# EAGLE board Mk3 Prototype (EAGLE 6.5.0), part 1 of 2
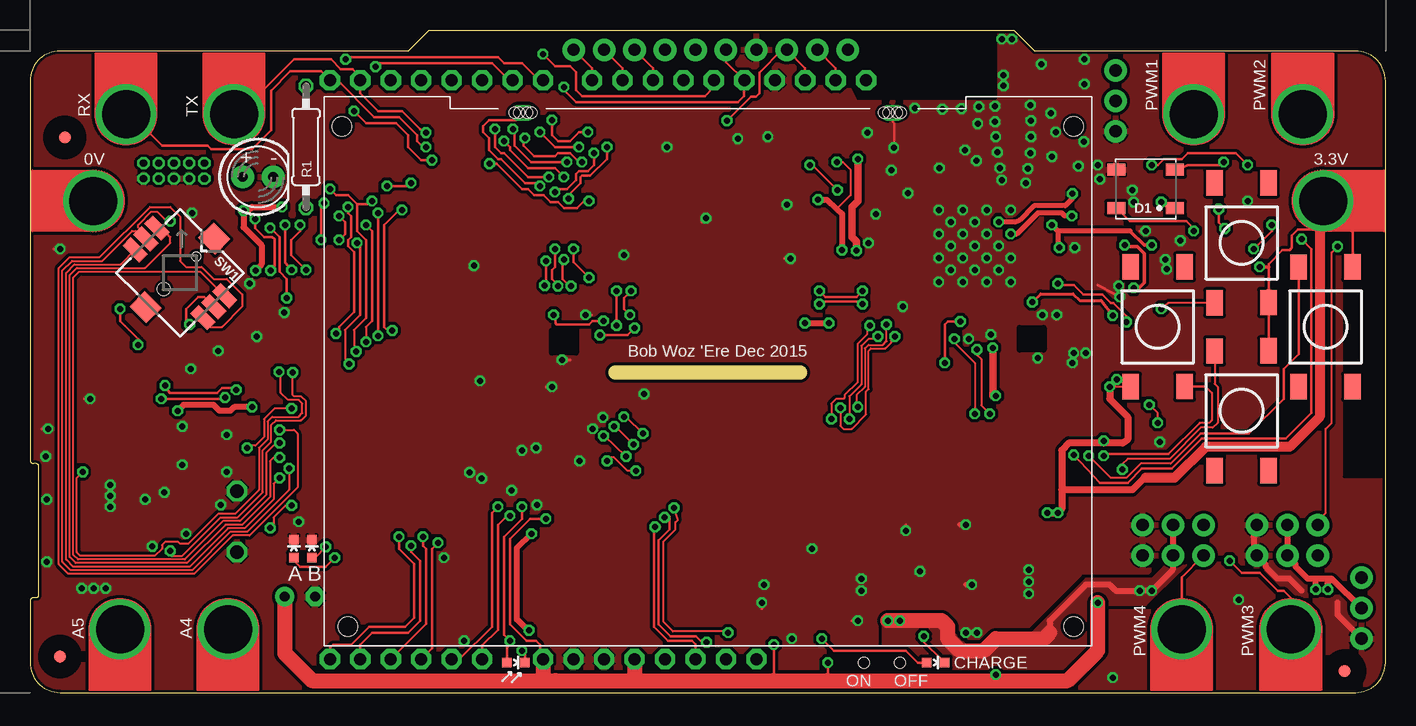
[diagram p2: board, top side]
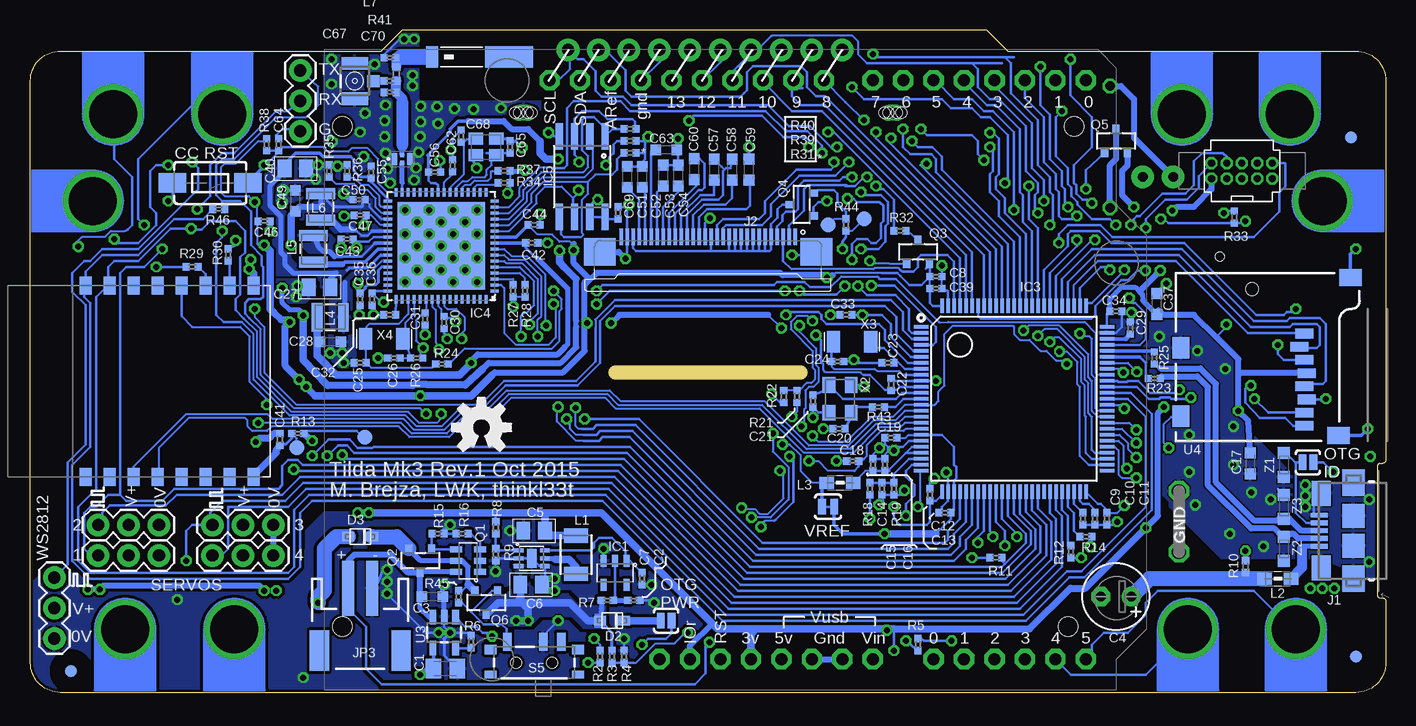
[diagram p3: board, bottom side, seen from below]

Size 113 x 55.25 mm. Coordinates in mm from the lower left corner, seen from the top.
Outline: 48.8,26.7 64.2,26.7
Outline: 2.5,0 110.5,0 arc90 113,2.5 113,51 arc90 110.5,53.5 83.75,53.5 82,55.25 33.25,55.25 31.5,53.5 2.5,53.5 arc90 0,51 0,19.4 arc90 0.3,19.1 0.5,19.1 arc-90 0.7,18.9 0.7,8.1 arc-90 0.5,7.9 0.3,7.9 arc90 0,7.6 0,2.5 arc90 2.5,0
Copper layers (1*16): Top 0.035mm / dielectric 1.4mm / Bottom 0.035mm
Design rules "TiLDA Mk3 DRC Rules *": minimum track width 0.15mm, minimum drill 0.5mm, track to track 0.15mm, track to pad 0.15mm, pad to pad 0.15mm, via to via 0.15mm, smd to smd 0.05mm, copper to edge 0.2mm, drill to drill 12mil, minimum pad ring 8mil, minimum via ring 8mil, stop-mask expansion 2mil, vias tented up to drill 25mil, thermal gap 0.15mm
Net classes: 0 default: width 0.15 mm, drill 0.3 mm; 1 ANT: width 1.27 mm, drill 0.4 mm, clearance 0.4 mm; 2 90R: width 0.5 mm, drill 0.3 mm, clearance 0.7 mm to class 0, clearance 0.1 mm; 3 100R: width 0.15 mm, drill 0.3 mm, clearance 0.6 mm to class 2, clearance 0.4 mm; 4 5V0: width 0.406 mm, drill 0.3 mm, clearance 0.6 mm to class 2, clearance 0.6 mm to class 3; 5 3V3: width 0.254 mm, drill 0.3 mm, clearance 0.6 mm to class 2, clearance 0.6 mm to class 3; 6 1V8: width 0.254 mm, drill 0.3 mm, clearance 0.6 mm to class 2, clearance 0.6 mm to class 3; 7 H5V0: width 0.254 mm, drill 0.3 mm, clearance 0.6 mm to class 2, clearance 0.6 mm to class 3; 8 MAINS: clearance 4 mm to class 0, clearance 4 mm to class 1, clearance 4 mm to class 2, clearance 4 mm to class 3, clearance 4 mm to class 4, clearance 4 mm to class 5, clearance 4 mm to class 6, clearance 4 mm to class 7, clearance 4 mm

## Footprints (pad centres in the part's own frame; a part is rotated, then mirrored left to right if it is on the bottom)
2450AT42A100 = smd 1 x 1.8: P$1 -0.5,0 | smd 4 x 1.8: P$2 5.9,0
C0805K = smd 1.3 x 1.6: 1 -1,0; 2 1,0
C0402-SMALLER = smd 0.6 x 0.6: 1 -0.5,0; 2 0.5,0
C0603K-SMALL = smd 0.889 x 0.889: 1 -0.875,0; 2 0.875,0
E2,5-6 = drill 0.813 pad 1.6: + -1.27,0 | drill 0.813 pad 1.6 octagon: - 1.27,0
C0805-N = smd 1.15 x 1.45: 1 -0.9,0; 2 0.9,0
WS2812B = smd 1.5 x 1: 1 -2.45,1.6; 2 -2.45,-1.6; 3 2.45,-1.6; 4 2.45,1.6
SOD-323F = smd 1 x 0.8: A -1,0; C 1,0
FIDUCIAL-1X2.5-STOP = smd 1 x 1: 1 0,0
DEA202450BT = smd 0.45 x 1: GND@2 0.65,0; GND@4 -0.65,0 | smd 0.35 x 0.35: IN 0,-0.325; OUT 0,0.325
GND-LOOP = drill 1.15 octagon: P$3 -2.54,0; P$4 2.54,0
SSOP5 = smd 0.5 x 1: 1 -0.95,-1; 2 0,-1; 3 0.95,-1; 4 0.95,1; 5 -0.95,1
DFN6 = smd 0.35 x 0.8: 1 -0.65,-1.1; 2 0,-1.1; 3 0.65,-1.1; 4 0.65,1.1; 5 0,1.1; 6 -0.65,1.1 | smd 1.6 x 0.8: EP 0,0
TQFP100 = smd 0.3 x 1.2: 1 -6,-7.75; 2 -5.5,-7.75; 3 -5,-7.75; 4 -4.5,-7.75; 5 -4,-7.75; 6 -3.5,-7.75; 7 -3,-7.75; 8 -2.5,-7.75; 9 -2,-7.75; 10 -1.5,-7.75; 11 -1,-7.75; 12 -0.5,-7.75; 13 0,-7.75; 14 0.5,-7.75; 15 1,-7.75; 16 1.5,-7.75; 17 2,-7.75; 18 2.5,-7.75; 19 3,-7.75; 20 3.5,-7.75; 21 4,-7.75; 22 4.5,-7.75; 23 5,-7.75; 24 5.5,-7.75; 25 6,-7.75; 51 6,7.75; 52 5.5,7.75; 53 5,7.75; 54 4.5,7.75; 55 4,7.75; 56 3.5,7.75; 57 3,7.75; 58 2.5,7.75; 59 2,7.75; 60 1.5,7.75; 61 1,7.75; 62 0.5,7.75; 63 0,7.75; 64 -0.5,7.75; 65 -1,7.75; 66 -1.5,7.75; 67 -2,7.75; 68 -2.5,7.75; 69 -3,7.75; 70 -3.5,7.75; 71 -4,7.75; 72 -4.5,7.75; 73 -5,7.75; 74 -5.5,7.75; 75 -6,7.75 | smd 1.2 x 0.3: 26 7.75,-6; 27 7.75,-5.5; 28 7.75,-5; 29 7.75,-4.5; 30 7.75,-4; 31 7.75,-3.5; 32 7.75,-3; 33 7.75,-2.5; 34 7.75,-2; 35 7.75,-1.5; 36 7.75,-1; 37 7.75,-0.5; 38 7.75,0; 39 7.75,0.5; 40 7.75,1; 41 7.75,1.5; 42 7.75,2; 43 7.75,2.5; 44 7.75,3; 45 7.75,3.5; 46 7.75,4; 47 7.75,4.5; 48 7.75,5; 49 7.75,5.5; 50 7.75,6; 76 -7.75,6; 77 -7.75,5.5; 78 -7.75,5; 79 -7.75,4.5; 80 -7.75,4; 81 -7.75,3.5; 82 -7.75,3; 83 -7.75,2.5; 84 -7.75,2; 85 -7.75,1.5; 86 -7.75,1; 87 -7.75,0.5; 88 -7.75,0; 89 -7.75,-0.5; 90 -7.75,-1; 91 -7.75,-1.5; 92 -7.75,-2; 93 -7.75,-2.5; 94 -7.75,-3; 95 -7.75,-3.5; 96 -7.75,-4; 97 -7.75,-4.5; 98 -7.75,-5; 99 -7.75,-5.5; 100 -7.75,-6
VQFN-64 = smd 0.25 x 0.7: 1 -3.75,-4.45; 2 -3.25,-4.45; 3 -2.75,-4.45; 4 -2.25,-4.45; 5 -1.75,-4.45; 6 -1.25,-4.45; 7 -0.75,-4.45; 8 -0.25,-4.45; 9 0.25,-4.45; 10 0.75,-4.45; 11 1.25,-4.45; 12 1.75,-4.45; 13 2.25,-4.45; 14 2.75,-4.45; 15 3.25,-4.45; 16 3.75,-4.45; 33 3.75,4.45; 34 3.25,4.45; 35 2.75,4.45; 36 2.25,4.45; 37 1.75,4.45; 38 1.25,4.45; 39 0.75,4.45; 40 0.25,4.45; 41 -0.25,4.45; 42 -0.75,4.45; 43 -1.25,4.45; 44 -1.75,4.45; 45 -2.25,4.45; 46 -2.75,4.45; 47 -3.25,4.45; 48 -3.75,4.45 | smd 0.7 x 0.25: 17 4.45,-3.75; 18 4.45,-3.25; 19 4.45,-2.75; 20 4.45,-2.25; 21 4.45,-1.75; 22 4.45,-1.25; 23 4.45,-0.75; 24 4.45,-0.25; 25 4.45,0.25; 26 4.45,0.75; 27 4.45,1.25; 28 4.45,1.75; 29 4.45,2.25; 30 4.45,2.75; 31 4.45,3.25; 32 4.45,3.75; 49 -4.45,3.75; 50 -4.45,3.25; 51 -4.45,2.75; 52 -4.45,2.25; 53 -4.45,1.75; 54 -4.45,1.25; 55 -4.45,0.75; 56 -4.45,0.25; 57 -4.45,-0.25; 58 -4.45,-0.75; 59 -4.45,-1.25; 60 -4.45,-1.75; 61 -4.45,-2.25; 62 -4.45,-2.75; 63 -4.45,-3.25; 64 -4.45,-3.75 | smd 7.3 x 7.3: PAD 0,0
SO08-EIAJ = smd 0.61 x 2.21: 1 -1.905,-3.378; 2 -0.635,-3.378; 3 0.635,-3.378; 4 1.905,-3.378; 5 1.905,3.353; 6 0.635,3.353; 7 -0.635,3.353; 8 -1.905,3.353
USB-AB-MICRO-SMD_LWK = smd 1.4 x 0.4: D+ 2.85,0; D- 2.85,0.65; GND 2.85,-1.3; ID 2.85,-0.65; VBUS 2.85,1.3 | smd 1.6 x 2.1: SHIELD 2.675,3.1; SHIELD@5 2.675,-3.1 | smd 1.9 x 2: SHIELD@0 0,1.25; SHIELD@1 0,-1.25 | smd 1.9 x 2.2: SHIELD@2 0,-4; SHIELD@3 0,4
SFV30R-2STE1HLF = smd 0.3 x 1.4: 1 -7.25,-2.8; 2 -6.75,-2.8; 3 -6.25,-2.8; 4 -5.75,-2.8; 5 -5.25,-2.8; 6 -4.75,-2.8; 7 -4.25,-2.8; 8 -3.75,-2.8; 9 -3.25,-2.8; 10 -2.75,-2.8; 11 -2.25,-2.8; 12 -1.75,-2.8; 13 -1.25,-2.8; 14 -0.75,-2.8; 15 -0.25,-2.8; 16 0.25,-2.8; 17 0.75,-2.8; 18 1.25,-2.8; 19 1.75,-2.8; 20 2.25,-2.8; 21 2.75,-2.8; 22 3.25,-2.8; 23 3.75,-2.8; 24 4.25,-2.8; 25 4.75,-2.8; 26 5.25,-2.8; 27 5.75,-2.8; 28 6.25,-2.8; 29 6.75,-2.8; 30 7.25,-2.8 | smd 2.65 x 2.3: M1 9.025,-1.55; M2 -9.025,-1.55
SWD_PTH_SHROUD = drill 0.6 octagon: 1 -2.54,-0.635; 2 -2.54,0.635; 3 -1.27,-0.635; 4 -1.27,0.635; 5 0,-0.635; 6 0,0.635; 7 1.27,-0.635; 8 1.27,0.635; 9 2.54,-0.635; 10 2.54,0.635
JST-2-SMD = smd 1 x 4.6: 1 -1,-3.7; 2 1,-3.7 | smd 1.6 x 3.4: NC1 -3.4,1.5; NC2 3.4,1.5
1X10-NOSILK = drill 1.016 pad 1.88: 1 0,0; 2 2.54,0; 3 5.08,0; 4 7.62,0; 5 10.16,0; 6 12.7,0; 7 15.24,0; 8 17.78,0; 9 20.32,0; 10 22.86,0
1210 = smd 1.2 x 2: 1 -1.6,0; 2 1.6,0
WUERTH-0805 = smd 1.2 x 1: 1 -1.1,0; 2 1.1,0
1008 = smd 0.9 x 2.4: 1 -1.1,0; 2 1.1,0
L0402 = smd 0.6 x 0.7: 1 -0.6,0; 2 0.6,0
LED5MM = drill 0.813 pad 1.88: A -1.27,0; K 1.27,0
LED-0603-CORRECT = smd 0.8 x 0.8: A 0.75,0; C -0.75,0
SOT26 = smd 0.5 x 1: 1 -0.95,-1; 2 0,-1; 3 0.95,-1; 4 0.95,1; 5 0,1; 6 -0.95,1
SOT23-R = smd 0.6 x 0.7: 1 -0.95,-1; 2 0.95,-1; 3 0,1
0207/10 = drill 0.813 octagon: 1 -5.08,0; 2 5.08,0
R0402-SMALLER = smd 0.6 x 0.6: 1 -0.5,0; 2 0.5,0
TACTILE_SWITCH_TALL = smd 2.1 x 1.4: A1 -5,-2.25; A2 5,-2.25; B1 -5,2.25; B2 4.975,2.25
SWITCH-SPST-SMD-A = smd 0.7 x 1.5: 1 -2.25,-1.75; 2 -0.75,-1.75; 3 2.25,-1.75 | smd 1 x 0.6: GND1 -3.65,1; GND3 3.65,1 | smd 1 x 0.8: GND2 -3.65,-1.1; GND4 3.65,-1.1 | hole 0.9: -1.5,0; 1.5,0
TACTILE-SWITCH-1101NE = smd 2.3 x 1.6: 1 -3.15,0; 2 3.15,0
PAD-JUMPER-2-NO_YES_SILK = smd 0.635 x 1.27: 1 -0.45,0; 2 0.45,0
SJ_2S-TRACE = smd 0.635 x 1.27: 1 -0.508,0; 2 0.508,0
1X03 = drill 1.016 pad 1.88: 1 0,0; 2 2.54,0; 3 5.08,0
JOYSTICK_MULTICOMP = smd 2 x 1: A -4,1.275; B 4,1.275; C -4,-1.275; COM 4,0; CTR -4,0; D 4,-1.275 | smd 2 x 1.8: NC 0,4.05; NC@0 0,-4.05 | hole 0.75: 0,1.9 | hole 1.05: 0,-1.9
4MMEDGE = drill 4: P$1 0,-1.27
B1,27 = smd 1.27 x 1.27: TP 0,0
JHD12864-G13BSW-OUTLINE = drill 0.9 long: A 47.4,1.35; K 16.6,1.35 | hole 1.6: 1.5,2.5; 62.5,2.5; 1.5,44.2; 62,44.2 | hole 0.9: 48.1,1.35; 46.7,1.35; 16.95,1.35; 15.9,1.35; 47.75,1.35; 47.05,1.35; 17.3,1.35; 16.25,1.35
ARDUINOR3-NODIM = drill 1 pad 1.676 octagon: 3V 35.56,2.54; 5V 38.1,2.54; A0 50.8,2.54; A1 53.34,2.54; A2 55.88,2.54; A3 58.42,2.54; A4 60.96,2.54; A5 63.5,2.54; AREF 23.876,50.8; D0 63.5,50.8; D1 60.96,50.8; D2 58.42,50.8; D3 55.88,50.8; D4 53.34,50.8; D5 50.8,50.8; D6 48.26,50.8; D7 45.72,50.8; D8 41.656,50.8; D9 39.116,50.8; D10 36.576,50.8; D11 34.036,50.8; D12 31.496,50.8; D13 28.956,50.8; GND 26.416,50.8; GND1 43.18,2.54; GND2 40.64,2.54; IOREF 30.48,2.54; RESERVED 27.94,2.54; RESET 33.02,2.54; SCL 18.796,50.8; SDA 21.336,50.8; VIN 45.72,2.54
SOT23-5 = smd 0.55 x 1.2: 1 -0.95,-1.3; 2 0,-1.3; 3 0.95,-1.3; 4 0.95,1.3; 5 -0.95,1.3
MICRO-SD-SOCKET-PP = smd 0.8 x 1.5: 1 -8.94,10.7; 2 -7.84,10.3; 3 -6.74,10.7; 4 -5.64,10.9; 5 -4.54,10.7; 6 -3.44,10.9; 7 -2.34,10.7; 8 -1.24,10.7 | smd 1.8 x 1.4: CD1 -2.05,0.4; CD2 -7.75,0.4 | smd 1.4 x 1.9: GND1 -13.6,14.55; GND3 -0.45,13.55
ESP-07 = smd 1 x 1.5: 1 -13.4,0; 2 -11.4,0; 3 -9.4,0; 4 -7.4,0; 5 -5.4,0; 6 -3.4,0; 7 -1.4,0; 8 0.6,0; 9 0.6,15.95; 10 -1.4,15.95; 11 -3.4,15.95; 12 -5.4,15.95; 13 -7.4,15.95; 14 -9.4,15.95; 15 -11.4,15.95; 16 -13.4,15.95
CRYSTAL-3.2-2.5 = smd 1.3 x 1.05: 1 -1.15,-0.925; 2 1.15,-0.925; 3 1.15,0.925; 4 -1.15,0.925
RESONATOR_EPSON_FC_145 = smd 1.1 x 1.8: P$1 -1.55,0; P$2 1.55,0
CRYSTAL-2.5X2.0 = smd 1.2 x 1: 1 -0.85,0.7; 2 0.85,0.7; 3 0.85,-0.7; 4 -0.85,-0.7
MC-921 = smd 1 x 1.05: 1 0,1.528 | smd 1.05 x 2.2: 2@1 -1.475,0; 2@2 1.475,0
CT/CN0603 = smd 1 x 1: 1 -1,0; 2 1,0

## Placement (x,y rotation side)
ANT2  CHIPANT  [2450AT42A100]  79,53 0 bottom
C1  0603/4u7/10V/X5R  [C0805K]  78.4,2 180 bottom
C2  0402/4u7/6.3V/X5R  [C0402-SMALLER]  62.7,7.7 0 bottom
C3  0603/4u7/10V/X5R  [C0603K-SMALL]  79.5,8 180 bottom
C4  DNP (OTG)  [E2,5-6]  22.5,8 180 bottom
C5  0805/10u/10V/X5R  [C0805-N]  71,13.5 180 bottom
C6  0805/10u/10V/X5R  [C0805-N]  71.25,9 0 bottom
C7  0402/10n/25V/X7R  [C0402-SMALLER]  62,9.5 270 bottom
C8  0402/4u7/6.3V/X5R  [C0402-SMALLER]  37.5,34.7 180 bottom
C9  0402/2.2u/6.3V/X5R  [C0402-SMALLER]  25.25,14.5 90 bottom
C10  0402/0R  [C0402-SMALLER]  24.25,14.5 90 bottom
C11  0402/100n/10V/X5R  [C0402-SMALLER]  23.25,14.5 90 bottom
C12  0402/100n/10V/X5R  [C0402-SMALLER]  36.75,15 0 bottom
C13  0402/1u/10V/X5R  [C0402-SMALLER]  38,16.5 270 bottom
C14  0402/1u/10V/X5R  [C0402-SMALLER]  42,17 90 bottom
C15  0402/10n/25V/X7R  [C0402-SMALLER]  42.75,19 270 bottom
C16  0402/100n/10V/X5R  [C0402-SMALLER]  41.75,19 270 bottom
C17  0603/4u7/10V/X5R  [C0603K-SMALL]  11.3,19.1 90 bottom
C18  0402/1u/10V/X5R  [C0402-SMALLER]  44.45,19.3 0 bottom
C19  0402/100n/10V/X5R  [C0402-SMALLER]  41.25,21.25 0 bottom
C20  0402/10p/50V/NP0  [C0402-SMALLER]  45.6,22 0 bottom
C21  0402/10p/50V/NP0  [C0402-SMALLER]  47.75,24.3 90 bottom
C22  0402/100n/10V/X5R  [C0402-SMALLER]  41.25,25.69 270 bottom
C23  0402/10p/50V/NP0  [C0402-SMALLER]  41.5,27.5 0 bottom
C24  0402/10p/50V/NP0  [C0402-SMALLER]  45.7,27.6 180 bottom
C25  DNP - 0402/10p/50V/NP0  [C0402-SMALLER]  85.5,27.5 0 bottom
C26  DNP - 0402/10p/50V/NP0  [C0402-SMALLER]  82.7,27.9 0 bottom
C27  0805/22u/??V/X5R  [C0805-N]  88.9,33.8 0 bottom
C28  0603/10u/6.3V/X5R  [C0603K-SMALL]  88,29.25 180 bottom
C29  0402/2.2u/6.3V/X5R  [C0402-SMALLER]  21.3,30.39 270 bottom
C30  0402/100n/10V/X5R  [C0402-SMALLER]  78.5,30.85 90 bottom
C31  0402/100n/10V/X5R  [C0402-SMALLER]  80.1,31.15 90 bottom
C32  0402/100n/10V/X5R  [C0402-SMALLER]  83.05,31.5 0 bottom
C33  0402/1u/10V/X5R  [C0402-SMALLER]  45,31.5 0 bottom
C34  0402/100n/10V/X5R  [C0402-SMALLER]  22.52,31.8 180 bottom
C35  0402/4u7/6.3V/X5R  [C0402-SMALLER]  85.5,32.8 90 bottom
C36  0402/100n/10V/X5R  [C0402-SMALLER]  84.5,32.8 90 bottom
C37  0603/4u7/10V/X5R  [C0603K-SMALL]  19.1,32.4 270 bottom
C39  0402/100n/10V/X5R  [C0402-SMALLER]  37.5,33.7 180 bottom
C40  0805/22u/??V/X5R  [C0805-N]  90.9,43.7 180 bottom
C41  0402/4u7/6.3V/X5R  [C0402-SMALLER]  92.2,21.1 270 bottom
C42  0402/100n/10V/X5R  [C0402-SMALLER]  71.2,37.5 180 bottom
C43  0402/4u7/6.3V/X5R  [C0402-SMALLER]  86.6,37.8 0 bottom
C44  0402/100n/10V/X5R  [C0402-SMALLER]  71,39 180 bottom
C46  0402/1u/10V/X5R  [C0402-SMALLER]  93.5,39.3 180 bottom
C47  0402/4u7/6.3V/X5R  [C0402-SMALLER]  85.5,39.8 0 bottom
C49  0603/10u/6.3V/X5R  [C0603K-SMALL]  90.9,41 270 bottom
C50  0402/100n/10V/X5R  [C0402-SMALLER]  85.6,41.1 0 bottom
C51  0603/1u/16V/X5R  [C0603K-SMALL]  63.25,43 270 bottom
C52  0603/1u/16V/X5R  [C0603K-SMALL]  62,43 270 bottom
C53  0603/1u/16V/X5R  [C0603K-SMALL]  60.25,43.1 270 bottom
C54  0603/1u/16V/X5R  [C0603K-SMALL]  59,43.1 270 bottom
C55  0402/1u/10V/X5R  [C0402-SMALLER]  84.6,43.4 270 bottom
C56  0402/100n/10V/X5R  [C0402-SMALLER]  79.3,43.4 180 bottom
C57  0603/1u/16V/X5R  [C0603K-SMALL]  56,43.6 270 bottom
C58  0603/1u/16V/X5R  [C0603K-SMALL]  54.5,43.6 270 bottom
C59  0603/1u/16V/X5R  [C0603K-SMALL]  53.1,43.6 270 bottom
C60  0603/1u/16V/X5R  [C0603K-SMALL]  57.65,43.65 90 bottom
C62  0402/100n/10V/X5R  [C0402-SMALLER]  77.8,43.95 270 bottom
C63  0603/1u/16V/X5R  [C0603K-SMALL]  60,45.25 180 bottom
C64  0402/100n/10V/X5R  [C0402-SMALLER]  92.3,45.7 270 bottom
C65  0402/6.0p/50V/NP0  [C0402-SMALLER]  73,45.5 270 bottom
C67  0402/1p/50V/NP0  [C0402-SMALLER]  83,50.05 180 bottom
C68  0402/6.0p/50V/NP0  [C0402-SMALLER]  77.1,46.4 270 bottom
C69  0402/100n/10V/X5R  [C0402-SMALLER]  64,40 270 bottom
C70  0402/??/50V/NP0  [C0402-SMALLER]  83,52.95 180 bottom
D1  [WS2812B]  93,42 180 top
D2  [SOD-323F]  64.5,6 0 bottom
D3  [SOD-323F]  85.5,13 0 bottom
FID1  FIDUCIAL1X2.5-STOP  [FIDUCIAL-1X2.5-STOP]  2.9,46.3 90 top
FID2  FIDUCIAL1X2.5-STOP  [FIDUCIAL-1X2.5-STOP]  109.6,1.8 0 top
FID3  FIDUCIAL1X2.5-STOP  [FIDUCIAL-1X2.5-STOP]  2.5,3 0 top
FID4  FIDUCIAL1X2.5-STOP  [FIDUCIAL-1X2.5-STOP]  2.5,3 0 bottom
FID5  FIDUCIAL1X2.5-STOP  [FIDUCIAL-1X2.5-STOP]  109.6,1.8 0 bottom
FID6  FIDUCIAL1X2.5-STOP  [FIDUCIAL-1X2.5-STOP]  2.9,46.3 90 bottom
FL1  DEA202450BT-1294C1-H  [DEA202450BT]  82,44.5 0 bottom
G1  GND-LOOP  [GND-LOOP]  17.25,14.25 270 bottom
IC1  BD49XXX  [SSOP5]  64.25,10 180 bottom
IC2  NCP1529MU  [DFN6]  71.2,11.2 270 bottom
IC3  STM32F401V  [TQFP100]  31,24.5 270 bottom
IC4  CC3100  [VQFN-64]  78.75,37.25 90 bottom
IC5  S25FL216K0PMFI011  [SO08-EIAJ]  67,43 180 bottom
J1  ZX62-AB-5PA(11)  [USB-AB-MICRO-SMD_LWK]  2.7,13.5 180 bottom
J2  SFV30R-2STE1HLF  [SFV30R-2STE1HLF]  56.5,35.2 180 bottom
J3  SWD_SHROUD  [SWD_PTH_SHROUD]  12,43.5 0 bottom
JP3  [JST-2-SMD]  85.5,5 180 bottom
JP4  M10NOSILK  [1X10-NOSILK]  45.32,53.6 180 bottom
L1  2u2 SRN2512-2R2M  [1210]  67.5,11.5 90 bottom
L2  Bead  [WUERTH-0805]  9,9.5 180 bottom
L3  Bead  [WUERTH-0805]  45.5,17.5 0 bottom
L4  1008/2u2/1300mA  [1008]  88,31.3 0 bottom
L5  1008/1u/1500mA  [1008]  89.4,37 90 bottom
L6  1008/2u2/1300mA  [1008]  88.8,40.5 270 bottom
L7  0402/?? (0R for prototype)  [L0402]  82.5,51.6 90 bottom
LED1  [LED5MM]  19,43 0 top
LED2  [LED-0603-CORRECT]  22,12 270 top
LED3  [LED-0603-CORRECT]  23.5,12 270 top
LED4  [LED-0603-CORRECT]  40.5,2.5 180 top
LED5  [LED-0603-CORRECT]  75.5,2.5 180 top
LOGO1  OSHW-LOGOM  [OSHW-LOGO-M]  75.4,22.1 0 bottom
Q1  DMMT5401  [SOT26]  76.5,11 90 bottom
Q2  NTR4101  [SOT23-R]  80.5,11 180 bottom
Q3  NTR4101  [SOT23-R]  39,36.75 0 bottom
Q4  NTR4101  [SOT23-R]  48.7,40.7 90 bottom
Q5  NTR4101  [SOT23-R]  22.5,46 0 bottom
Q6  NTR4101  [SOT23-R]  75,7.5 180 bottom
R1  [0207/10]  23,45.5 270 top
R2  0402/220/5%  [R0402-SMALLER]  65.5,3 270 bottom
R3  0402/220k/5%  [R0402-SMALLER]  64.5,3 270 bottom
R4  0402/220k/5%  [R0402-SMALLER]  63.5,3 90 bottom
R5  0402/2M2/5%  [R0402-SMALLER]  39,4 90 bottom
R6  0402/2k/5%  [R0402-SMALLER]  76.25,4.25 90 bottom
R7  0402/47k/5%  [R0402-SMALLER]  64.9,7.7 0 bottom
R8  0402/91k/1%  [R0402-SMALLER]  74.2,13.75 270 bottom
R9  0402/22k/1%  [R0402-SMALLER]  74.2,11.5 270 bottom
R10  0402/1k/5%  [R0402-SMALLER]  11.7,10.5 270 bottom
R11  0402/100K/5%  [R0402-SMALLER]  32.5,11.25 0 bottom
R12  0402/150/5%  [R0402-SMALLER]  26.25,11.75 90 bottom
R13  0402/0.1R/5%  [R0402-SMALLER]  90.7,21.6 180 bottom
R14  0402/150/5%  [R0402-SMALLER]  25,13 180 bottom
R15  0402/47k/5%  [R0402-SMALLER]  79,13.25 0 bottom
R16  0402/10k/5%  [R0402-SMALLER]  77,13.25 180 bottom
R18  0402/220k/5%  [R0402-SMALLER]  43,17 90 bottom
R19  0402/220k/5%  [R0402-SMALLER]  41,17 270 bottom
R21  0402/220K/5%  [R0402-SMALLER]  49.1,24.7 270 bottom
R22  0402/220K/5%  [R0402-SMALLER]  50.2,24.7 270 bottom
R23  0402/22/1%  [R0402-SMALLER]  19.3,26.2 0 bottom
R24  0402/0R  [R0402-SMALLER]  78.7,27.4 180 bottom
R25  0402/22/1%  [R0402-SMALLER]  19.3,27.9 270 bottom
R26  0402/100K/5%  [R0402-SMALLER]  80.8,27.9 180 bottom
R27  0402/100K/5%  [R0402-SMALLER]  72.75,33.5 270 bottom
R28  0402/100K/5%  [R0402-SMALLER]  71.75,33.5 270 bottom
R29  0402/100K/5%  [R0402-SMALLER]  99.5,35.5 0 bottom
R30  0402/100K/5%  [R0402-SMALLER]  96.5,36.5 270 bottom
R31  0402/100K/5%  [R0402-SMALLER]  63,45 0 bottom
R32  0402/12R/5%  [R0402-SMALLER]  40.5,38.5 0 bottom
R33  0402/100K/5%  [R0402-SMALLER]  12.65,39.64 270 bottom
R34  0402/100K/5%  [R0402-SMALLER]  73.5,42.5 0 bottom
R35  0402/100K/5%  [R0402-SMALLER]  88.1,43.5 90 bottom
R36  0402/100K/5%  [R0402-SMALLER]  86.6,43.5 90 bottom
R37  0402/10K/5%  [R0402-SMALLER]  73.5,43.5 0 bottom
R38  0402/100K/5%  [R0402-SMALLER]  93.3,45.7 270 bottom
R39  0402/100K/5%  [R0402-SMALLER]  63,46 0 bottom
R40  0402/100K/5%  [R0402-SMALLER]  63,47 180 bottom
R41  DNP (0ohm)  [R0402-SMALLER]  83,51 0 bottom
R43  0402/220/5%  [R0402-SMALLER]  42.3,23.8 180 bottom
R44  0402/1R/5%  [R0402-SMALLER]  45,39 90 bottom
R45  0402/220k/5%  [R0402-SMALLER]  77.3,8 270 bottom
R46  0402/10K/5%  [R0402-SMALLER]  97.3,40.3 0 bottom
S1  SWITCH-MOMENTARY-2  [TACTILE_SWITCH_TALL]  101,37.5 270 top
S2  SWITCH-MOMENTARY-2  [TACTILE_SWITCH_TALL]  94,30.5 270 top
S3  SWITCH-MOMENTARY-2  [TACTILE_SWITCH_TALL]  108,30.5 90 top
S4  SWITCH-MOMENTARY-2  [TACTILE_SWITCH_TALL]  101,23.5 90 top
S5  [SWITCH-SPST-SMD-A]  71,2.5 180 bottom
S6  SWITCH-MOMENTARY-2SMD-1101NE  [TACTILE-SWITCH-1101NE]  98,42.5 180 bottom
SJ1  JUMPER-PAD-2-NOYES_SILK  [PAD-JUMPER-2-NO_YES_SILK]  60,6 0 bottom
SJ2  SOLDERJUMPERTRACE  [SJ_2S-TRACE]  46.5,15.5 180 bottom
SJ3  JUMPER-PAD-2-NOYES_SILK  [PAD-JUMPER-2-NO_YES_SILK]  6.5,19.2 180 bottom
SV1  [1X03]  90.5,46.8 90 bottom
SV2  [1X03]  111,4.5 90 bottom
SV3  [1X03]  102.28,11.43 180 bottom
SV4  [1X03]  92.75,11.43 180 bottom
SV5  [1X03]  102.28,13.97 180 bottom
SV6  [1X03]  92.75,13.97 180 bottom
SW1  JOYSTICK_MINI_MULTICOMP  [JOYSTICK_MULTICOMP]  12.5,35 315 top
TP1  TP4MM  [4MMEDGE]  8,49.5 0 top
TP2  TP4MM  [4MMEDGE]  17,49.5 0 top
TP3  TP4MM  [4MMEDGE]  97,49.5 0 top
TP4  TP4MM  [4MMEDGE]  106.1,49.5 0 top
TP5  TP4MM  [4MMEDGE]  4,41 90 top
TP6  TP4MM  [4MMEDGE]  109.07,41 270 top
TP7  TP4MM  [4MMEDGE]  7.5,4 180 top
TP8  TP4MM  [4MMEDGE]  16.5,4 180 top
TP9  TP4MM  [4MMEDGE]  96,4 180 top
TP10  TP4MM  [4MMEDGE]  105.1,4 180 top
TP11  TPB1,27  [B1,27]  85.1,21.3 0 bottom
TP12  TPB1,27  [B1,27]  43.5,39.5 0 bottom
TP13  TPB1,27  [B1,27]  46.5,39 0 bottom
TP14  TPB1,27  [B1,27]  90.8,20.4 0 bottom
U1  JHD12864-G13BSW-OUTLINE  [JHD12864-G13BSW-OUTLINE]  88.5,49.7 180 top
U2  ARDUINOR3-NODIM  [ARDUINOR3-NODIM]  88.5,0.25 0 bottom
U3  MCP73831  [SOT23-5]  78.5,5 180 bottom
U4  USD-SOCKETNEW  [MICRO-SD-SOCKET-PP]  17.5,21 270 bottom
X1  ESP-07  [ESP-07]  95,18 0 bottom
X2  16MHz-3.2-2.5  [CRYSTAL-3.2-2.5]  45.5,24.5 90 bottom
X3  ABS07-32.768KHZ-T  [RESONATOR_EPSON_FC_145]  44.5,29.25 180 bottom
X4  DNP - ABS07-32.768KHZ-T  [RESONATOR_EPSON_FC_145]  83.5,29.5 180 bottom
X5  Q24FA20H00396  [CRYSTAL-2.5X2.0]  75,45.5 0 bottom
X6  MC-921  [MC-921]  85.95,51 270 bottom
Z1  VARISTORCN0603  [CT/CN0603]  8.5,19 270 bottom
Z2  VARISTORCN0603  [CT/CN0603]  8.5,12 270 bottom
Z3  VARISTORCN0603  [CT/CN0603]  8.5,15.5 90 bottom